# Altium schematic sheet ARM7_Sharp_LH79520_Memory.SchDoc
size B; DocumentNumber: 1; SheetNumber: 1; SheetTotal: 1
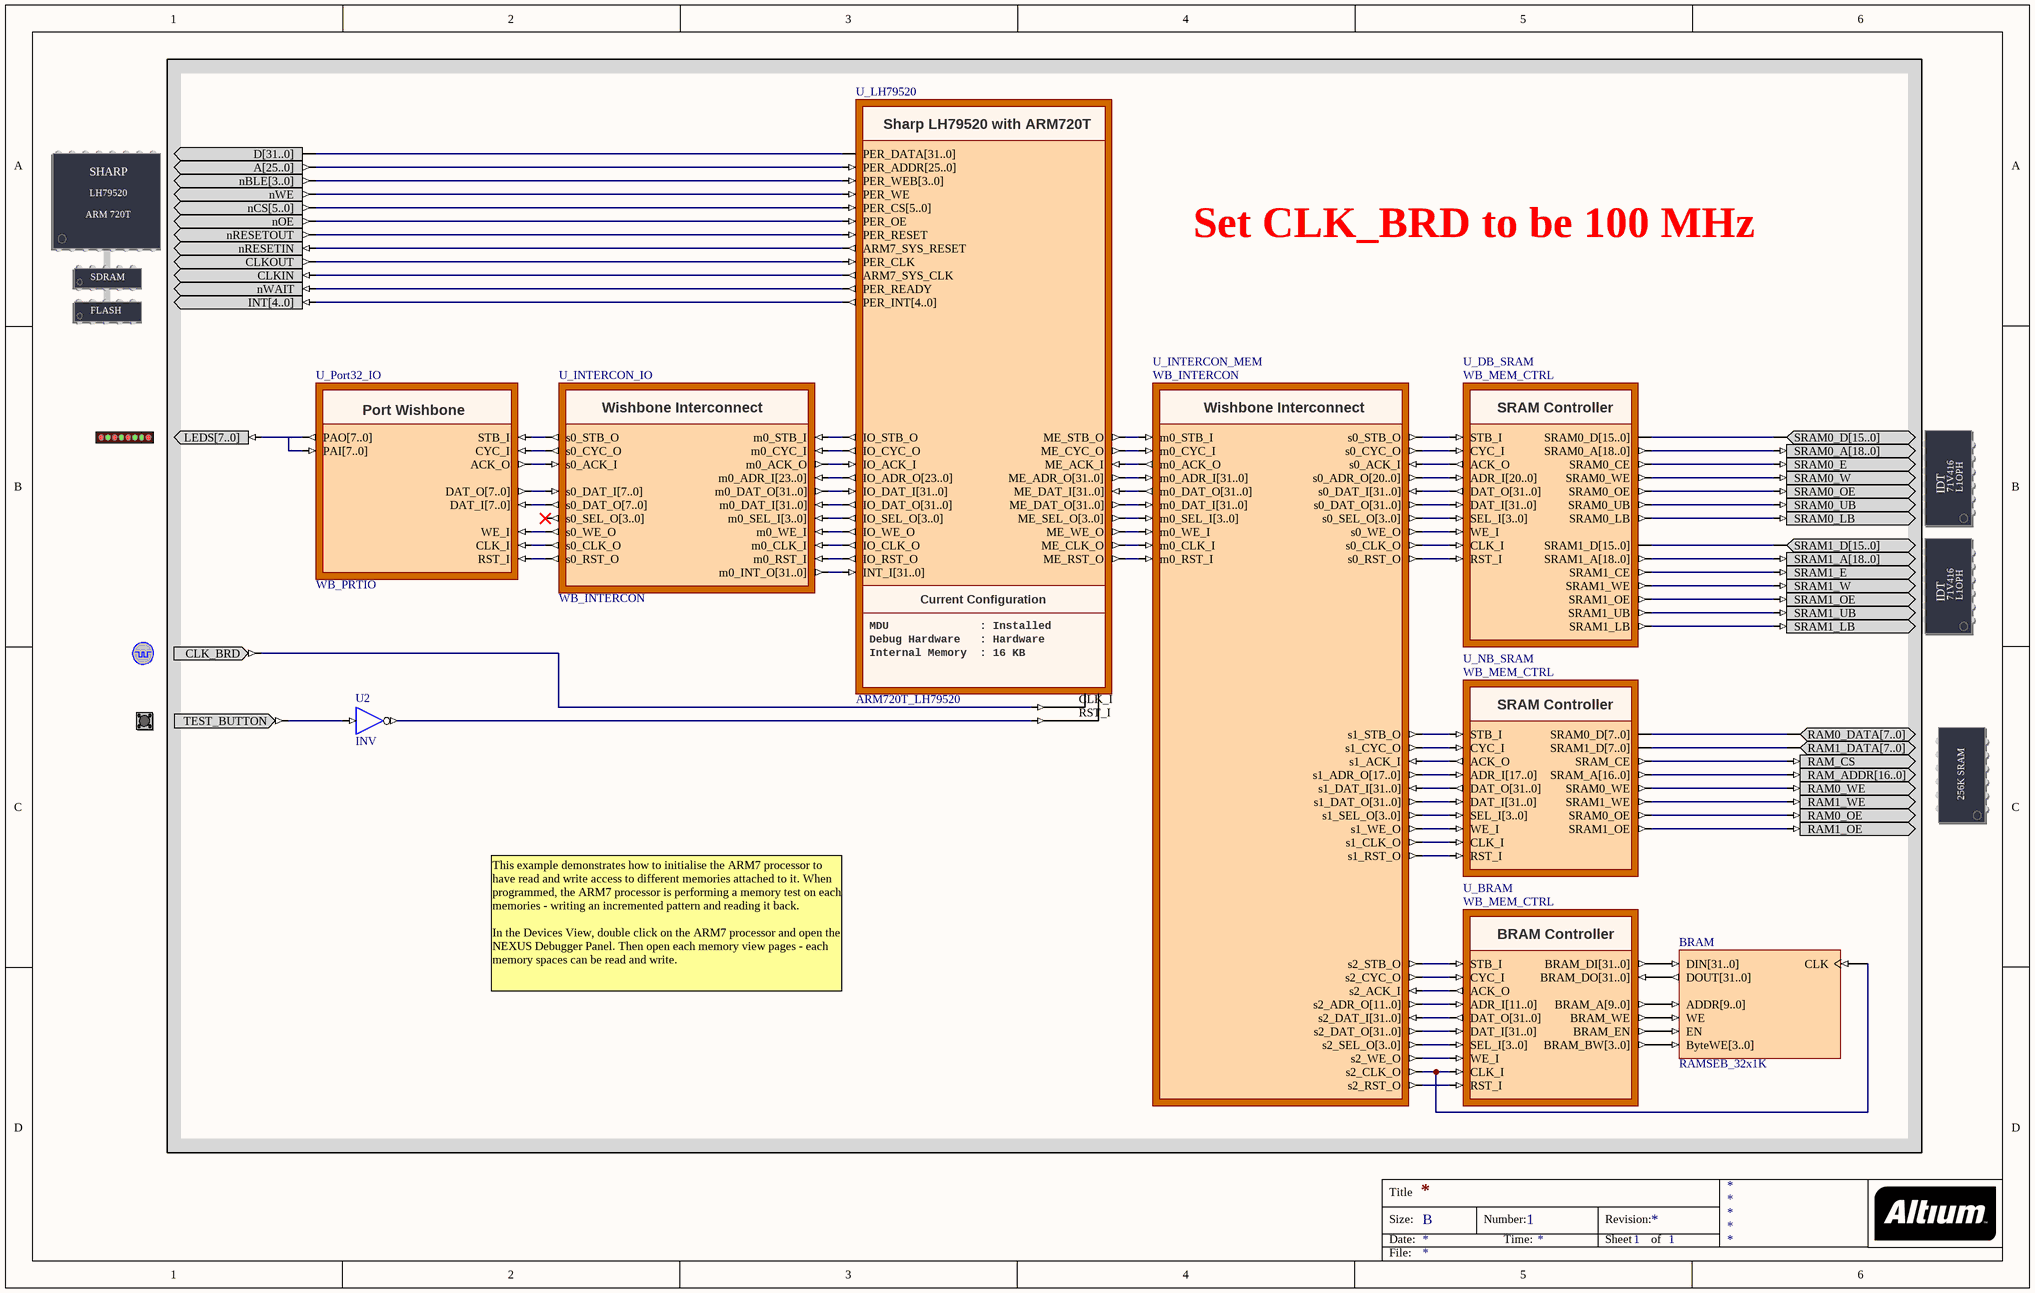
[diagram p0: ARM7_Sharp_LH79520_Memory.SchDoc]

## Parts
(Parts that share a designator on the sheet are numbered #1, #2 ... from top to bottom, then left to right.)
?#1  PROCESSOR_ARM7_LH79520  (value not drawn)
?#2  SRAM_DAUGHTER0  (value not drawn)
?#3  LED  (value not drawn)
?#4  SRAM_DAUGHTER1  (value not drawn)
?#5  CLOCK_BOARD  (value not drawn)
?#6  TEST_BUTTON  (value not drawn)
?#7  MEMORY256KX8  (value not drawn)
BRAM  RAMSEB_32x1K
U2  INV
U_BRAM  WB_MEM_CTRL
U_DB_SRAM  WB_MEM_CTRL
U_INTERCON_IO  WB_INTERCON
U_INTERCON_MEM  WB_INTERCON
U_LH79520  ARM720T_LH79520
U_NB_SRAM  WB_MEM_CTRL
U_Port32_IO  WB_PRTIO

## Blocks framed on the sheet
Set CLK_BRD to be 100 MHz: ?#1-?#7 BRAM U2 U_BRAM U_DB_SRAM U_INTERCON_IO U_INTERCON_MEM U_LH79520 U_NB_SRAM U_Port32_IO

## Nets
Net?#1_A[25..0]: ?#1.A[25..0] U_LH79520.PER_ADDR[25..0]
Net?#1_CLKIN: ?#1.CLKIN U_LH79520.ARM7_SYS_CLK
Net?#1_CLKOUT: ?#1.CLKOUT U_LH79520.PER_CLK
Net?#1_D[31..0]: ?#1.D[31..0] U_LH79520.PER_DATA[31..0]
Net?#1_INT[4..0]: ?#1.INT[4..0] U_LH79520.PER_INT[4..0]
Net?#1_nBLE[3..0]: ?#1.nBLE[3..0] U_LH79520.PER_WEB[3..0]
Net?#1_nCS[5..0]: ?#1.nCS[5..0] U_LH79520.PER_CS[5..0]
Net?#1_nOE: ?#1.nOE U_LH79520.PER_OE
Net?#1_nRESETIN: ?#1.nRESETIN U_LH79520.ARM7_SYS_RESET
Net?#1_nRESETOUT: ?#1.nRESETOUT U_LH79520.PER_RESET
Net?#1_nWAIT: ?#1.nWAIT U_LH79520.PER_READY
Net?#1_nWE: ?#1.nWE U_LH79520.PER_WE
Net?#2_SRAM0_A[18..0]: ?#2.SRAM0_A[18..0] U_DB_SRAM.SRAM0_A[18..0]
Net?#2_SRAM0_D[15..0]: ?#2.SRAM0_D[15..0] U_DB_SRAM.SRAM0_D[15..0]
Net?#2_SRAM0_E: ?#2.SRAM0_E U_DB_SRAM.SRAM0_CE
Net?#2_SRAM0_LB: ?#2.SRAM0_LB U_DB_SRAM.SRAM0_LB
Net?#2_SRAM0_OE: ?#2.SRAM0_OE U_DB_SRAM.SRAM0_OE
Net?#2_SRAM0_UB: ?#2.SRAM0_UB U_DB_SRAM.SRAM0_UB
Net?#2_SRAM0_W: ?#2.SRAM0_W U_DB_SRAM.SRAM0_WE
Net?#3_LEDS[7..0]: ?#3.LEDS[7..0] U_Port32_IO.PAI[7..0] U_Port32_IO.PAO[7..0]
Net?#4_SRAM1_A[18..0]: ?#4.SRAM1_A[18..0] U_DB_SRAM.SRAM1_A[18..0]
Net?#4_SRAM1_D[15..0]: ?#4.SRAM1_D[15..0] U_DB_SRAM.SRAM1_D[15..0]
Net?#4_SRAM1_E: ?#4.SRAM1_E U_DB_SRAM.SRAM1_CE
Net?#4_SRAM1_LB: ?#4.SRAM1_LB U_DB_SRAM.SRAM1_LB
Net?#4_SRAM1_OE: ?#4.SRAM1_OE U_DB_SRAM.SRAM1_OE
Net?#4_SRAM1_UB: ?#4.SRAM1_UB U_DB_SRAM.SRAM1_UB
Net?#4_SRAM1_W: ?#4.SRAM1_W U_DB_SRAM.SRAM1_WE
Net?#5_CLK_BRD: ?#5.CLK_BRD U_LH79520.CLK_I
Net?#6_TEST_BUTTON: ?#6.TEST_BUTTON U2.I
Net?#7_RAM0_DATA[7..0]: ?#7.RAM0_DATA[7..0] U_NB_SRAM.SRAM0_D[7..0]
Net?#7_RAM0_OE: ?#7.RAM0_OE U_NB_SRAM.SRAM0_OE
Net?#7_RAM0_WE: ?#7.RAM0_WE U_NB_SRAM.SRAM0_WE
Net?#7_RAM1_DATA[7..0]: ?#7.RAM1_DATA[7..0] U_NB_SRAM.SRAM1_D[7..0]
Net?#7_RAM1_OE: ?#7.RAM1_OE U_NB_SRAM.SRAM1_OE
Net?#7_RAM1_WE: ?#7.RAM1_WE U_NB_SRAM.SRAM1_WE
Net?#7_RAM_ADDR[16..0]: ?#7.RAM_ADDR[16..0] U_NB_SRAM.SRAM_A[16..0]
Net?#7_RAM_CS: ?#7.RAM_CS U_NB_SRAM.SRAM_CE
NetBRAM_ADDR[9..0]: BRAM.ADDR[9..0] U_BRAM.BRAM_A[9..0]
NetBRAM_ByteWE[3..0]: BRAM.ByteWE[3..0] U_BRAM.BRAM_BW[3..0]
NetBRAM_CLK: BRAM.CLK U_BRAM.CLK_I U_INTERCON_MEM.s2_CLK_O
NetBRAM_DIN[31..0]: BRAM.DIN[31..0] U_BRAM.BRAM_DI[31..0]
NetBRAM_DOUT[31..0]: BRAM.DOUT[31..0] U_BRAM.BRAM_DO[31..0]
NetBRAM_EN: BRAM.EN U_BRAM.BRAM_EN
NetBRAM_WE: BRAM.WE U_BRAM.BRAM_WE
NetU2_O: U2.O U_LH79520.RST_I
NetU_BRAM_ACK_O: U_BRAM.ACK_O U_INTERCON_MEM.s2_ACK_I
NetU_BRAM_ADR_I[11..0]: U_BRAM.ADR_I[11..0] U_INTERCON_MEM.s2_ADR_O[11..0]
NetU_BRAM_CYC_I: U_BRAM.CYC_I U_INTERCON_MEM.s2_CYC_O
NetU_BRAM_DAT_I[31..0]: U_BRAM.DAT_I[31..0] U_INTERCON_MEM.s2_DAT_O[31..0]
NetU_BRAM_DAT_O[31..0]: U_BRAM.DAT_O[31..0] U_INTERCON_MEM.s2_DAT_I[31..0]
NetU_BRAM_RST_I: U_BRAM.RST_I U_INTERCON_MEM.s2_RST_O
NetU_BRAM_SEL_I[3..0]: U_BRAM.SEL_I[3..0] U_INTERCON_MEM.s2_SEL_O[3..0]
NetU_BRAM_STB_I: U_BRAM.STB_I U_INTERCON_MEM.s2_STB_O
NetU_BRAM_WE_I: U_BRAM.WE_I U_INTERCON_MEM.s2_WE_O
NetU_DB_SRAM_ACK_O: U_DB_SRAM.ACK_O U_INTERCON_MEM.s0_ACK_I
NetU_DB_SRAM_ADR_I[20..0]: U_DB_SRAM.ADR_I[20..0] U_INTERCON_MEM.s0_ADR_O[20..0]
NetU_DB_SRAM_CLK_I: U_DB_SRAM.CLK_I U_INTERCON_MEM.s0_CLK_O
NetU_DB_SRAM_CYC_I: U_DB_SRAM.CYC_I U_INTERCON_MEM.s0_CYC_O
NetU_DB_SRAM_DAT_I[31..0]: U_DB_SRAM.DAT_I[31..0] U_INTERCON_MEM.s0_DAT_O[31..0]
NetU_DB_SRAM_DAT_O[31..0]: U_DB_SRAM.DAT_O[31..0] U_INTERCON_MEM.s0_DAT_I[31..0]
NetU_DB_SRAM_RST_I: U_DB_SRAM.RST_I U_INTERCON_MEM.s0_RST_O
NetU_DB_SRAM_SEL_I[3..0]: U_DB_SRAM.SEL_I[3..0] U_INTERCON_MEM.s0_SEL_O[3..0]
NetU_DB_SRAM_STB_I: U_DB_SRAM.STB_I U_INTERCON_MEM.s0_STB_O
NetU_DB_SRAM_WE_I: U_DB_SRAM.WE_I U_INTERCON_MEM.s0_WE_O
NetU_INTERCON_IO_m0_ACK_O: U_INTERCON_IO.m0_ACK_O U_LH79520.IO_ACK_I
NetU_INTERCON_IO_m0_ADR_I[23..0]: U_INTERCON_IO.m0_ADR_I[23..0] U_LH79520.IO_ADR_O[23..0]
NetU_INTERCON_IO_m0_CLK_I: U_INTERCON_IO.m0_CLK_I U_LH79520.IO_CLK_O
NetU_INTERCON_IO_m0_CYC_I: U_INTERCON_IO.m0_CYC_I U_LH79520.IO_CYC_O
NetU_INTERCON_IO_m0_DAT_I[31..0]: U_INTERCON_IO.m0_DAT_I[31..0] U_LH79520.IO_DAT_O[31..0]
NetU_INTERCON_IO_m0_DAT_O[31..0]: U_INTERCON_IO.m0_DAT_O[31..0] U_LH79520.IO_DAT_I[31..0]
NetU_INTERCON_IO_m0_INT_O[31..0]: U_INTERCON_IO.m0_INT_O[31..0] U_LH79520.INT_I[31..0]
NetU_INTERCON_IO_m0_RST_I: U_INTERCON_IO.m0_RST_I U_LH79520.IO_RST_O
NetU_INTERCON_IO_m0_SEL_I[3..0]: U_INTERCON_IO.m0_SEL_I[3..0] U_LH79520.IO_SEL_O[3..0]
NetU_INTERCON_IO_m0_STB_I: U_INTERCON_IO.m0_STB_I U_LH79520.IO_STB_O
NetU_INTERCON_IO_m0_WE_I: U_INTERCON_IO.m0_WE_I U_LH79520.IO_WE_O
NetU_INTERCON_IO_s0_ACK_I: U_INTERCON_IO.s0_ACK_I U_Port32_IO.ACK_O
NetU_INTERCON_IO_s0_CLK_O: U_INTERCON_IO.s0_CLK_O U_Port32_IO.CLK_I
NetU_INTERCON_IO_s0_CYC_O: U_INTERCON_IO.s0_CYC_O U_Port32_IO.CYC_I
NetU_INTERCON_IO_s0_DAT_I[7..0]: U_INTERCON_IO.s0_DAT_I[7..0] U_Port32_IO.DAT_O[7..0]
NetU_INTERCON_IO_s0_DAT_O[7..0]: U_INTERCON_IO.s0_DAT_O[7..0] U_Port32_IO.DAT_I[7..0]
NetU_INTERCON_IO_s0_RST_O: U_INTERCON_IO.s0_RST_O U_Port32_IO.RST_I
NetU_INTERCON_IO_s0_STB_O: U_INTERCON_IO.s0_STB_O U_Port32_IO.STB_I
NetU_INTERCON_IO_s0_WE_O: U_INTERCON_IO.s0_WE_O U_Port32_IO.WE_I
NetU_INTERCON_MEM_m0_ACK_O: U_INTERCON_MEM.m0_ACK_O U_LH79520.ME_ACK_I
NetU_INTERCON_MEM_m0_ADR_I[31..0]: U_INTERCON_MEM.m0_ADR_I[31..0] U_LH79520.ME_ADR_O[31..0]
NetU_INTERCON_MEM_m0_CLK_I: U_INTERCON_MEM.m0_CLK_I U_LH79520.ME_CLK_O
NetU_INTERCON_MEM_m0_CYC_I: U_INTERCON_MEM.m0_CYC_I U_LH79520.ME_CYC_O
NetU_INTERCON_MEM_m0_DAT_I[31..0]: U_INTERCON_MEM.m0_DAT_I[31..0] U_LH79520.ME_DAT_O[31..0]
NetU_INTERCON_MEM_m0_DAT_O[31..0]: U_INTERCON_MEM.m0_DAT_O[31..0] U_LH79520.ME_DAT_I[31..0]
NetU_INTERCON_MEM_m0_RST_I: U_INTERCON_MEM.m0_RST_I U_LH79520.ME_RST_O
NetU_INTERCON_MEM_m0_SEL_I[3..0]: U_INTERCON_MEM.m0_SEL_I[3..0] U_LH79520.ME_SEL_O[3..0]
NetU_INTERCON_MEM_m0_STB_I: U_INTERCON_MEM.m0_STB_I U_LH79520.ME_STB_O
NetU_INTERCON_MEM_m0_WE_I: U_INTERCON_MEM.m0_WE_I U_LH79520.ME_WE_O
NetU_INTERCON_MEM_s1_ACK_I: U_INTERCON_MEM.s1_ACK_I U_NB_SRAM.ACK_O
NetU_INTERCON_MEM_s1_ADR_O[17..0]: U_INTERCON_MEM.s1_ADR_O[17..0] U_NB_SRAM.ADR_I[17..0]
NetU_INTERCON_MEM_s1_CLK_O: U_INTERCON_MEM.s1_CLK_O U_NB_SRAM.CLK_I
NetU_INTERCON_MEM_s1_CYC_O: U_INTERCON_MEM.s1_CYC_O U_NB_SRAM.CYC_I
NetU_INTERCON_MEM_s1_DAT_I[31..0]: U_INTERCON_MEM.s1_DAT_I[31..0] U_NB_SRAM.DAT_O[31..0]
NetU_INTERCON_MEM_s1_DAT_O[31..0]: U_INTERCON_MEM.s1_DAT_O[31..0] U_NB_SRAM.DAT_I[31..0]
NetU_INTERCON_MEM_s1_RST_O: U_INTERCON_MEM.s1_RST_O U_NB_SRAM.RST_I
NetU_INTERCON_MEM_s1_SEL_O[3..0]: U_INTERCON_MEM.s1_SEL_O[3..0] U_NB_SRAM.SEL_I[3..0]
NetU_INTERCON_MEM_s1_STB_O: U_INTERCON_MEM.s1_STB_O U_NB_SRAM.STB_I
NetU_INTERCON_MEM_s1_WE_O: U_INTERCON_MEM.s1_WE_O U_NB_SRAM.WE_I

Not connected (* = marked no-connect by the designer): U_INTERCON_IO s0_SEL_O[3..0]*

## Notes on the sheet
- This example demonstrates how to initialise the ARM7 processor to have read and write access to different memories attached to it. When programmed, the ARM7 processor is performing a memory test on each memories - writing an incremented pattern and reading it back.
  In the Devices View, double click on the ARM7 processor and open the NEXUS Debugger Panel. Then open each memory view pages - each memory spaces can be read and write.
- Title
- Size:
- Date:
- B
- Number:
- Time:
- Revision:
- Sheet
- of
- File:
- (in symbol ARM720T_LH79520) Sharp LH79520 with ARM720T; Current Configuration; MDU              : Installed; Debug Hardware   : Hardware; Internal Memory  : 16 KB
- (in symbol MEMORY256KX8) 256K SRAM
- (in symbol PROCESSOR_ARM7_LH79520) SHARP; LH79520; ARM 720T; SDRAM; FLASH
- (in symbol SRAM_DAUGHTER0) IDT; 71V416; L1OPH
- (in symbol SRAM_DAUGHTER1) IDT; 71V416; L1OPH
- (in symbol WB_INTERCON) Wishbone Interconnect
- (in symbol WB_MEM_CTRL) BRAM Controller; SRAM Controller
- (in symbol WB_PRTIO) Port Wishbone

## Library data of the parts
?#1 = PROCESSOR_ARM7_LH79520: Sharp LH79520 with ARM 720T; PortComponent: True; Published: 06-Oct-2005; Publisher: Altium Limited; HelpURL: http://document.sharpsma.com/Handler/getfile_handler2.asp?nodeid=Documents&fileid=F91E6650EC6141068DF7F13902FCDBE4
?#2 = SRAM_DAUGHTER0: SRAM - 0 Module - Daughterboard; PortComponent: True; Published: 13-May-2004; Publisher: Altium Limited
?#3 = LED: 8-Way LEDS; PortComponent: True; Published: 19-Nov-2003; Publisher: Altium Limited; HelpURL: TR0102 NanoBoard Technical Reference Manual - NB1.pdf#page=41
?#4 = SRAM_DAUGHTER1: SRAM - 1 Module - Daughterboard; PortComponent: True; Published: 13-May-2004; Publisher: Altium Limited
?#5 = CLOCK_BOARD: Global System Clock Supply; PortComponent: True; Published: 19-Nov-2003; Publisher: Altium Limited
?#6 = TEST_BUTTON: Test Button; PortComponent: True; Published: 19-Nov-2003; Publisher: Altium Limited; HelpURL: TR0102 NanoBoard Technical Reference Manual - NB1.pdf#page=41
?#7 = MEMORY256KX8: SRAM 256kx8; PortComponent: True; Published: 19-Nov-2003; Publisher: Altium Limited; HelpURL: TR0102 NanoBoard Technical Reference Manual - NB1.pdf#page=33
BRAM = RAMSEB_32x1K: Single Port RAM, Enable, Byte Write Enable; Memory_Type: RAM_SinglePortBlock; Memory_ClockEdge: Rising; Nexus_Core: Memory_Program; Memory_EnablePin: True; Memory_Depth: 1024; Memory_Width: 32; Published: 11/10/2004; Publisher: Altium Hobart Technology Center; Memory_ByteWrites: True
U2 = INV: Inverter; FunctionalClass: Logic Primitive; ArchiveName: GENERIC; VHDLIB_SIM: GENERIC_LIB; Published: 29-Jan-2004; Publisher: Altium Limited; XilinxEquivalent: INV; LastRevisionNo: 1.00.00; HelpURL: CR0118 FPGA Generic Library Guide.pdf#page=291; ComponentLink1URL: CR0136 FPGA Logic Primitive Resource Usage.pdf#page=61; ComponentLink1Description: Core &Resource Usage; SubClass: INV
U_BRAM = WB_MEM_CTRL: Configurable Memory Controller; ConfigurationParameters: {}Version[1.0]{}Option_MemoryType[Block RAM]{}Option_MemorySize[4 Kb (1K x 32-bit)]{}Option_Layout[2 x 16-bit Wide Devices]{}Option_Read[2]{}Option_WriteSetup[1]{}Option_WritePulse[1]{}Option_WriteHold[1]{}; ComponentLink1Description: Core &Resource Usage; ComponentLink1URL: CR0139 FPGA Peripheral Resource Usage.pdf#page=58; HelpURL: CR0152 WB_MEM_CTRL Configurable Wishbone Memory Controller.pdf#page=2; LastRevisionNo: 1.00.00; Published: 9-Dec-2004; Publisher: Altium Limited; ConfiguratorName: WB_MEM_CTRL
U_DB_SRAM = WB_MEM_CTRL: Configurable Memory Controller; ConfigurationParameters: {}Version[1.0]{}Option_MemoryType[Asynchronous SRAM]{}Option_MemorySize[2 Mb (512K x 32-bit)]{}Option_Layout[2 x 16-bit Wide Devices]{}Option_Read[2]{}Option_WriteSetup[1]{}Option_WritePulse[1]{}Option_WriteHold[1]{}; ComponentLink1Description: Core &Resource Usage; ComponentLink1URL: CR0139 FPGA Peripheral Resource Usage.pdf#page=58; HelpURL: CR0152 WB_MEM_CTRL Configurable Wishbone Memory Controller.pdf#page=2; LastRevisionNo: 1.00.00; Published: 9-Dec-2004; Publisher: Altium Limited; ConfiguratorName: WB_MEM_CTRL
U_INTERCON_IO = WB_INTERCON: Configurable Wishbone Interconnect; ConfigurationParameters: {}Version[1.0]{}UnusedInterrupts[1]{}MasterAddressBits[1]{}Name0[LEDS]{}Kind0[0]{}SpaceAfter0[4]{}Address_Base0[0]{}Address_UsedRange0[1]{}Address_Bits0[0]{}Address_Mode0[1]{}Address_DecodeWidth0[1]{}DataWidth0[2]{}UsedInterrupts0[ ]; ComponentLink1Description: Core &Resource Usage; ComponentLink1URL: CR0139 FPGA Peripheral Resource Usage.pdf#page=51; HelpURL: CR0150 WB_INTERCON Configurable Wishbone Interconnect.pdf#page=2; LastRevisionNo: 1.00.00; Published: 9-Dec-2004; Publisher: Altium Limited; ConfiguratorName: WB_INTERCON
U_INTERCON_MEM = WB_INTERCON: Configurable Wishbone Interconnect; ConfigurationParameters: {}Version[1.0]{}UnusedInterrupts[2]{}MasterAddressBits[0]{}Name0[DB_RAM]{}Kind0[2]{}SpaceAfter0[12]{}Address_Base0[1140850688]{}Address_UsedRange0[1]{}Address_Bits0[21]{}Address_Mode0[1]{}Address_DecodeWidth0[6]{}DataWidth0[0]{}UsedInterrupts0[ ]{}Name1[NB_RAM]{}Kind1[2]{}SpaceAfter1[7]{}Address_Base1[1207959552]{}Address_UsedRange1[1]{}Address_Bits1[18]{}Address_Mode1[1]{}Address_DecodeWidth1[6]{}DataWidth1[0]{}UsedInterrupts1[ ]{}Name2[BRAM]{}Kind2[2]{}SpaceAfter2[12]{}Address_Base2[1342177280]{}Address_UsedRange2[524288]{}Address_Bits2[12]{}Address_Mode2[1]{}Address_DecodeWidth2[6]{}DataWidth2[0]{}UsedInterrupts2[ ]; ComponentLink1Description: Core &Resource Usage; ComponentLink1URL: CR0139 FPGA Peripheral Resource Usage.pdf#page=51; HelpURL: CR0150 WB_INTERCON Configurable Wishbone Interconnect.pdf#page=2; LastRevisionNo: 1.00.00; Published: 9-Dec-2004; Publisher: Altium Limited; ConfiguratorName: WB_INTERCON
U_LH79520 = ARM720T_LH79520: Sharp LH79520 with ARM 720T; Nexus_JTAG_Device: False; Nexus_Core: Processor_Hard; Nexus_JTAG_Order: 0; ConfigurationParameters: {}Version[1.0]{}Option_Processor[4]{}Option_Memory[4]{}Option_MDU[0]{}Option_OCDS[2]{}Option_Shifter[0]{}Option_InterruptCount[32]{}Option_DebugWhenReset[0]{}; ConfiguratorName: FPGA_MCU32; Memory_Configuration: Record[NEXUS_CORE]{}ComponentDesignator[U_LH79520]{}Memory_Depth[8k]{}Memory_UsageType[rom]{}ProgramDownloadAddress[0x00000000]{}Memory_BusType[ARM:local_bus]{}Memory_Mau[8]{}Memory_MatchedComponent[]{}Memory_Description[]{}Memory_FillBitPattern[]{}Memory_Interrupts[]{n}Record[NEXUS_CORE]{}ComponentDesignator[DB_RAM]{}Memory_Depth[0x200000]{}Memory_UsageType[ram]{}ProgramDownloadAddress[0x44000000]{}Memory_BusType[ARM:local_bus]{}Memory_Mau[8]{}Memory_MatchedComponent[]{}Memory_Description[U_INTERCON_MEM]{}Memory_FillBitPattern[]{}Memory_Interrupts[]{n}Record[NEXUS_CORE]{}ComponentDesignator[NB_RAM]{}Memory_Depth[0x40000]{}Memory_UsageType[ram]{}ProgramDownloadAddress[0x48000000]{}Memory_BusType[ARM:local_bus]{}Memory_Mau[8]{}Memory_MatchedComponent[]{}Memory_Description[U_INTERCON_MEM]{}Memory_FillBitPattern[]{}Memory_Interrupts[]{n}Record[NEXUS_CORE]{}ComponentDesignator[BRAM]{}Memory_Depth[0x1000]{}Memory_UsageType[ram]{}ProgramDownloadAddress[0x50000000]{}Memory_BusType[ARM:local_bus]{}Memory_Mau[8]{}Memory_MatchedComponent[]{}Memory_Description[U_INTERCON_MEM]{}Memory_FillBitPattern[]{}Memory_Interrupts[]{n}Record[NEXUS_CORE]{}ComponentDesignator[Internal_RAM]{}Memory_Depth[8k]{}Memory_UsageType[ram]{}ProgramDownloadAddress[0x2000]{}Memory_BusType[ARM:local_bus]{}Memory_Mau[8]{}Memory_MatchedComponent[]{}Memory_Description[]{}Memory_FillBitPattern[]{}Memory_Interrupts[]{n}Record[CODE_EXPORT]{}ExportType[1]{n}Record[PERIPHERAL]{}ComponentDesignator[LEDS]{}Memory_Depth[0x0001]{}Memory_UsageType[ram]{}ProgramDownloadAddress[0x54000000]{}Memory_BusType[ARM:local_bus]{}Memory_Mau[8]{}Memory_MatchedComponent[]{}Memory_Description[U_INTERCON_IO]{}Memory_FillBitPattern[]{}Memory_Interrupts[]{n}; ProgramLogicalTopAddress: 0; ComponentLink1Description: Core &Resource Usage; ComponentLink1URL: CR0140 FPGA Processor Resource Usage.pdf#page=17; HelpURL: CR0121 TSK3000A 32 bit RISC Processor.pdf; LastRevisionNo: 1.00.00; Published: 17-Nov-2004; Publisher: Altium Limited; ComponentLink2Description: Embedded &Tools Guide; ComponentLink2URL: GU0111 Using the TSK3000 Embedded Tools.pdf; ComponentLink3Description: Embedded T&echnical References; ComponentLink3URL: TR0109 TSK3000 Embedded Tools Reference.pdf
U_NB_SRAM = WB_MEM_CTRL: Configurable Memory Controller; ConfigurationParameters: {}Version[1.0]{}Option_MemoryType[Asynchronous SRAM]{}Option_MemorySize[256 Kb (64K x 32-bit)]{}Option_Layout[2 x  8-bit Wide Devices]{}Option_Read[2]{}Option_WriteSetup[1]{}Option_WritePulse[1]{}Option_WriteHold[1]{}; ComponentLink1Description: Core &Resource Usage; ComponentLink1URL: CR0139 FPGA Peripheral Resource Usage.pdf#page=58; HelpURL: CR0152 WB_MEM_CTRL Configurable Wishbone Memory Controller.pdf#page=2; LastRevisionNo: 1.00.00; Published: 9-Dec-2004; Publisher: Altium Limited; ConfiguratorName: WB_MEM_CTRL
U_Port32_IO = WB_PRTIO: Configurable Port Wishbone; ChildModel: PRTIO1X8_W; ConfigurationParameters: {}Version[1.0]{}PortCount[1]{}BusWidth[8]{}PortKind[0]{}; ComponentLink1Description: Core &Resource Usage; ComponentLink1URL: CR0139 FPGA Peripheral Resource Usage.pdf#page=63; HelpURL: CR0154 WB_PRTIO Configurable Wishbone Parallel Port Unit.pdf#page=2; LastRevisionNo: 1.00.00; Published: 9-Dec-2004; Publisher: Altium Limited; ConfiguratorName: WB_PRTIO